# Altium schematic sheet PLD_CAM_MUX.SchDoc: CAMs UART-Buffer
size A4; ApprovedBy: Piotr Kuligowski; CheckedBy: Piotr Kuligowski; Author: Michał Gumiela; SheetNumber: 9; SheetTotal: 13
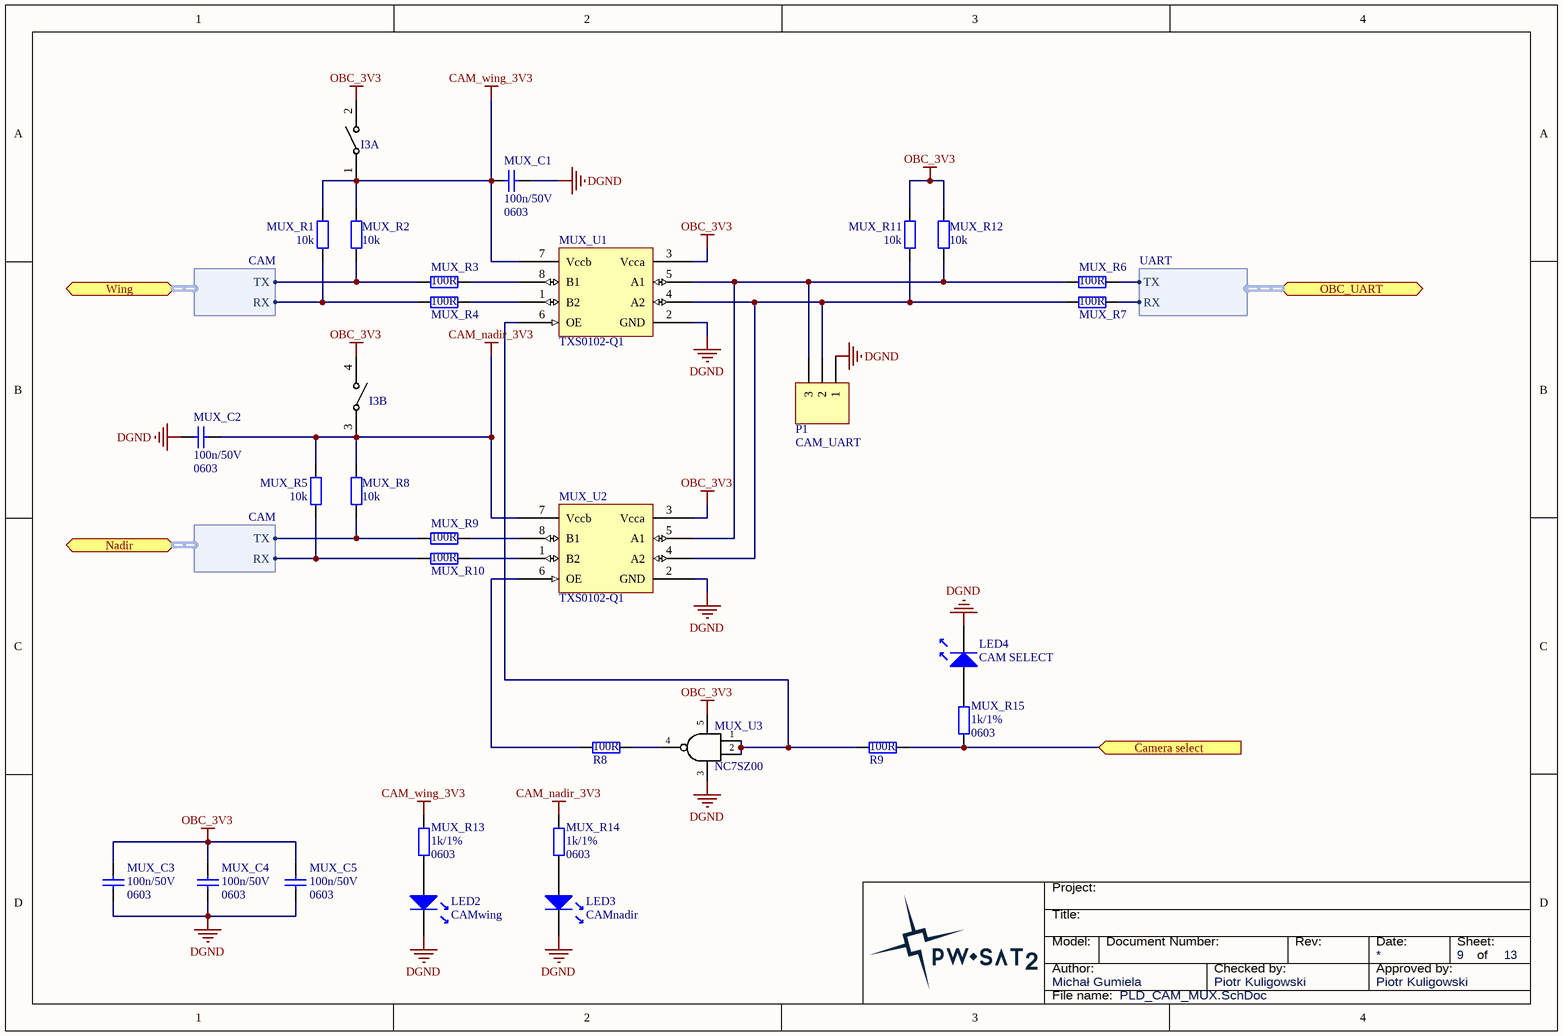
[diagram p0: PLD_CAM_MUX.SchDoc]

## Parts
I3  MCEPM-02  [MCEPM-02]  (value not drawn)  (parts A,B of 2)
LED2  CAMwing  [SMD_LED_1206]
LED3  CAMnadir  [SMD_LED_1206]
LED4  CAM SELECT  [SMD_LED_1206]
MUX_C1  Package: 0603  [SMD_Capacitor_0603]  (hidden comment: 100n/50V)
MUX_C2  Package: 0603  [SMD_Capacitor_0603]  (hidden comment: 100n/50V)
MUX_C3  Package: 0603  [SMD_Capacitor_0603]  (hidden comment: 100n/50V)
MUX_C4  Package: 0603  [SMD_Capacitor_0603]  (hidden comment: 100n/50V)
MUX_C5  Package: 0603  [SMD_Capacitor_0603]  (hidden comment: 100n/50V)
MUX_R1  10k  [SMD_Resistor_0603]
MUX_R2  10k  [SMD_Resistor_0603]
MUX_R3  100R  [SMD_Resistor_0603]
MUX_R4  100R  [SMD_Resistor_0603]
MUX_R5  10k  [SMD_Resistor_0603]
MUX_R6  100R  [SMD_Resistor_0603]
MUX_R7  100R  [SMD_Resistor_0603]
MUX_R8  10k  [SMD_Resistor_0603]
MUX_R9  100R  [SMD_Resistor_0603]
MUX_R10  100R  [SMD_Resistor_0603]
MUX_R11  10k  [SMD_Resistor_0603]
MUX_R12  10k  [SMD_Resistor_0603]
MUX_R13  Package: 0603  [SMD_Resistor_0603]  (hidden comment: 1k/1%)
MUX_R14  Package: 0603  [SMD_Resistor_0603]  (hidden comment: 1k/1%)
MUX_R15  Package: 0603  [SMD_Resistor_0603]  (hidden comment: 1k/1%)
MUX_U1  TXS0102-Q1  [VSSOP-8]
MUX_U2  TXS0102-Q1  [VSSOP-8]
MUX_U3  NC7SZ00  [SOT23-5]
P1  CAM_UART  [HEADER 1X3 MALE]
R8  100R  [SMD_Resistor_0603]
R9  100R  [SMD_Resistor_0603]

## Ports
Camera select (in), Nadir (harness CAM), OBC_UART (harness UART), Wing (harness CAM)

## Harnesses
UART: RX, TX
CAM: TX, RX

## Nets
CAM_nadir_3V3: I3.3 MUX_C2.1 MUX_R5.2 MUX_R8.2 MUX_R14.1 MUX_U2.7(Vccb)
CAM_wing_3V3: I3.1 MUX_C1.1 MUX_R1.2 MUX_R2.2 MUX_R13.1 MUX_U1.7(Vccb)
DGND: LED2.K LED3.K LED4.K MUX_C1.2 MUX_C2.2 MUX_C3.2 MUX_C4.2 MUX_C5.2 MUX_U1.2(GND) MUX_U2.2(GND) MUX_U3.3(GND) P1.1
OBC_3V3: I3.2 I3.4 MUX_C3.1 MUX_C4.1 MUX_C5.1 MUX_R11.2 MUX_R12.2 MUX_U1.3(Vcca) MUX_U2.3(Vcca) MUX_U3.5(Vcc)
Camera select: MUX_R15.1 R9.2 ; port Camera select
NetLED2_A: LED2.A MUX_R13.2
NetLED3_A: LED3.A MUX_R14.2
NetLED4_A: LED4.A MUX_R15.2
NetMUX_R1_1: MUX_R1.1 MUX_R4.1 ; port Wing.RX
NetMUX_R2_1: MUX_R2.1 MUX_R3.1 ; port Wing.TX
NetMUX_R3_2: MUX_R3.2 MUX_U1.8(B1)
NetMUX_R4_2: MUX_R4.2 MUX_U1.1(B2)
NetMUX_R5_1: MUX_R5.1 MUX_R10.1 ; port Nadir.RX
NetMUX_R6_1: MUX_R6.1 MUX_R12.1 MUX_U1.5(A1) MUX_U2.5(A1) P1.3
NetMUX_R6_2: MUX_R6.2 ; port OBC_UART.TX
NetMUX_R7_1: MUX_R7.1 MUX_R11.1 MUX_U1.4(A2) MUX_U2.4(A2) P1.2
NetMUX_R7_2: MUX_R7.2 ; port OBC_UART.RX
NetMUX_R8_1: MUX_R8.1 MUX_R9.1 ; port Nadir.TX
NetMUX_R9_2: MUX_R9.2 MUX_U2.8(B1)
NetMUX_R10_2: MUX_R10.2 MUX_U2.1(B2)
NetMUX_U1_6: MUX_U1.6(OE) MUX_U3.1(A) MUX_U3.2(B) R9.1
NetMUX_U2_6: MUX_U2.6(OE) R8.1
NetMUX_U3_4: MUX_U3.4(Y) R8.2

## Notes on the sheet
- Title:
- Project:
- Author:
- Model:
- Document Number:
- Checked by:
- Rev:
- Date:
- Approved by:
- Sheet:
- of
- File name:

## Library data of the parts
LED2-LED4 = LED-1206_RED: LED diode, SMD1206 package.; Supplier 1: Farnell; Farnell: 1581229
  LED2: Value: CAMwing
  LED3: Value: CAMnadir
  LED4: Value: CAM SELECT
MUX_C1-MUX_C5 = Cer_C0603T104K5RALTU: Ceramic Cap Kemet COTS 100n/50V X7R 0603; Manufacturer: Kemet; ManufacturerPartNumber: C0603T104K5RALTU; Value: 100n/50V
MUX_R1-MUX_R12 R8 R9 = Res: Package: 0603
  MUX_R1 MUX_R2 MUX_R5 MUX_R8 MUX_R11 MUX_R12: Value: 10k
  MUX_R3 MUX_R4 MUX_R6 MUX_R7 MUX_R9 MUX_R10 R8 R9: Value: 100R
MUX_R13-MUX_R15 = CRCW06031K00FKxxxx: 1k/1% Vishay CRCW 0603 Resistor. 100mW, 100ppm, 75V.; Manufacturer: Vishay; ManufacturerPartNumber: CRCW06031K00FKxxxx; Value: 1k/1%
MUX_U1 MUX_U2 = TXS0102-Q1: 2-Bit Bidirectional Voltage-Level Translator  for Open-Drain and Push-Pull Applications; Manufacturer: Texas Instruments; Value: TXS0102-Q1; ComponentLink1URL: http://www.ti.com/lit/ds/symlink/txs0102-q1.pdf; ComponentLink1Description: Description; HelpURL: http://www.ti.com/lit/ds/symlink/txs0102-q1.pdf
MUX_U3 = NC7SZ00: TinyLogic UHS Two-Input NAND Gate.; Manufacturer: Fairchild Semiconductor; Value: NC7SZ00
P1 = Header 3: Header, 3-Pin; LatestRevisionDate: 17-Jul-2002; LatestRevisionNote: Re-released for DXP Platform.; Publisher: Altium Limited
I3 = MCEPM-02: Supplier 1: Farnell